# Altium project PCB_Project.PrjPcb
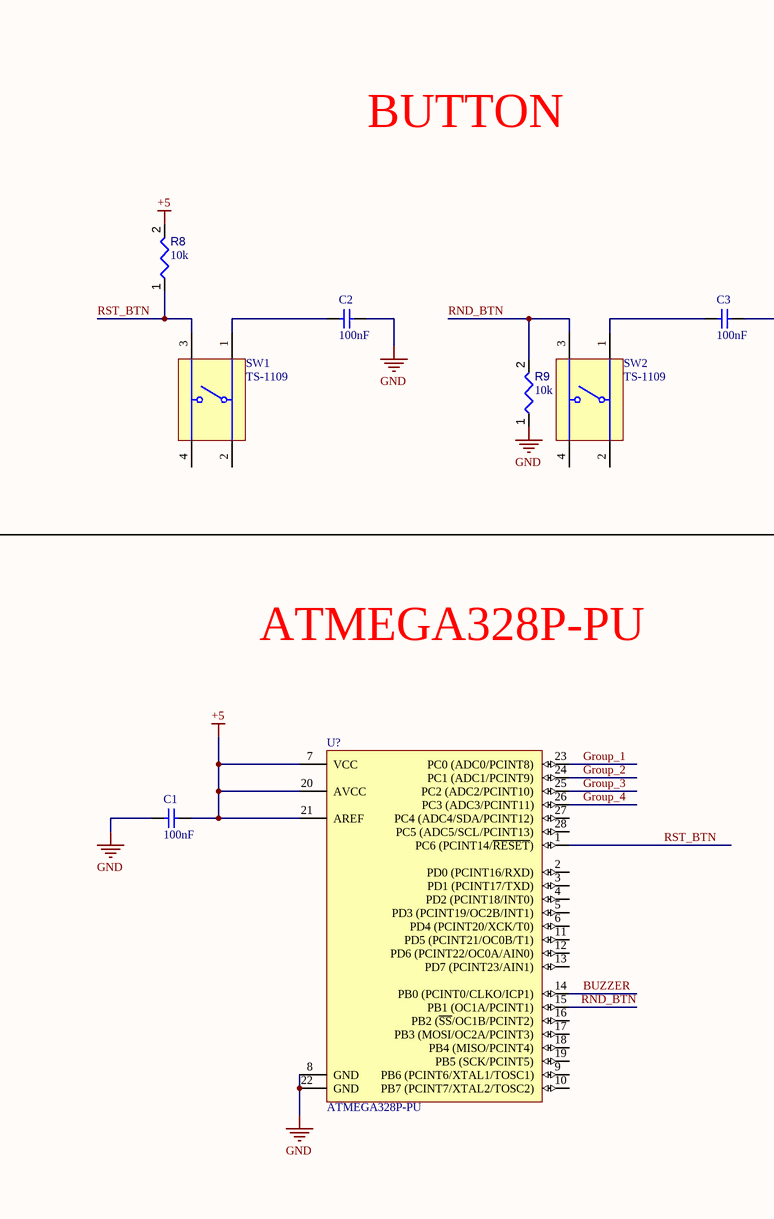
[diagram p0: Sheet1.SchDoc, left]
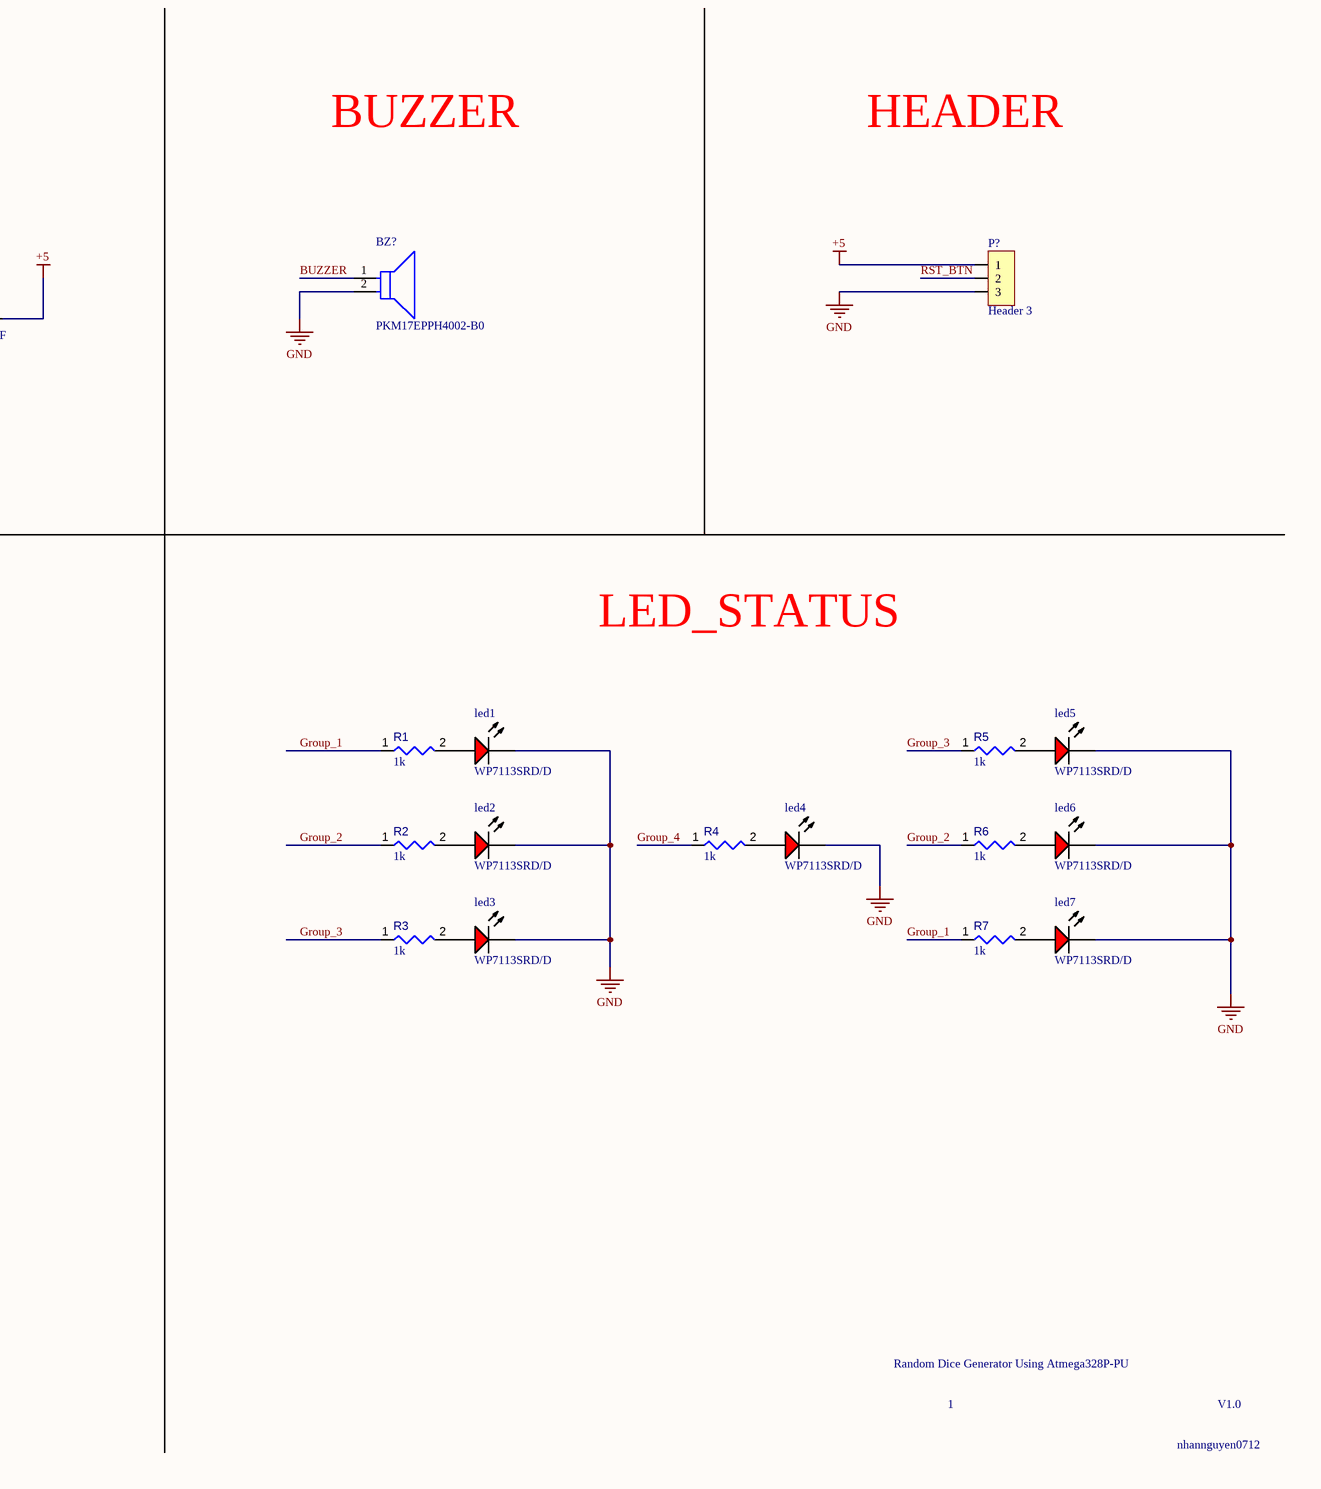
[diagram p1: Sheet1.SchDoc, right]
1 sheet, 24 parts. Net scope: global (net labels, ports and power ports of the same name join across sheets).
Board file: PCB1.PcbDoc

## Sheet Sheet1.SchDoc
size A3; SheetNumber: 1; SheetTotal: 1

### Parts
BZ?  PKM17EPPH4002-B0  [FP-PKM17EPPH4002-B0-MFG]
C1  100nF  [CAP Ceramic/W200]
C2  100nF  [CAP Ceramic/W200]
C3  100nF  [CAP Ceramic/W200]
led1  WP7113SRD/D  [KING-WP7113SRDD_V]
led2  WP7113SRD/D  [KING-WP7113SRDD_V]
led3  WP7113SRD/D  [KING-WP7113SRDD_V]
led4  WP7113SRD/D  [KING-WP7113SRDD_V]
led5  WP7113SRD/D  [KING-WP7113SRDD_V]
led6  WP7113SRD/D  [KING-WP7113SRDD_V]
led7  WP7113SRD/D  [KING-WP7113SRDD_V]
P?  Header 3  [HDR/Header/3/c1]
R1  value 1k  [RESA60-630X240]  (hidden comment: MFR-25FBF52-1K)
R2  value 1k  [RESA60-630X240]  (hidden comment: MFR-25FBF52-1K)
R3  value 1k  [RESA60-630X240]  (hidden comment: MFR-25FBF52-1K)
R4  value 1k  [RESA60-630X240]  (hidden comment: MFR-25FBF52-1K)
R5  value 1k  [RESA60-630X240]  (hidden comment: MFR-25FBF52-1K)
R6  value 1k  [RESA60-630X240]  (hidden comment: MFR-25FBF52-1K)
R7  value 1k  [RESA60-630X240]  (hidden comment: MFR-25FBF52-1K)
R8  value 10k  [RESA60-630X240]  (hidden comment: MFR-25FBF52-10K)
R9  value 10k  [RESA60-630X240]  (hidden comment: MFR-25FBF52-10K)
SW1  TS-1109  [BEST-TS-1109_V]
SW2  TS-1109  [BEST-TS-1109_V]
U?  ATMEGA328P-PU  [ATML-28P3]

### Nets
+5: C1.2 C3.2 P?.1 R8.2 U?.7(VCC) U?.20(AVCC) U?.21(AREF)
GND: BZ?.2 C1.1 C2.2 led1.2(K) led2.2(K) led3.2(K) led4.2(K) led5.2(K) led6.2(K) led7.2(K) P?.3 R9.1 U?.8(GND) U?.22(GND)
BUZZER: BZ?.1 U?.14(PB0_(PCINT0/CLKO/ICP1))
Group_1: R1.1 R7.1 U?.23(PC0_(ADC0/PCINT8))
Group_2: R2.1 R6.1 U?.24(PC1_(ADC1/PCINT9))
Group_3: R3.1 R5.1 U?.25(PC2_(ADC2/PCINT10))
Group_4: R4.1 U?.26(PC3_(ADC3/PCINT11))
RND_BTN: R9.2 SW2.3 U?.15(PB1_(OC1A/PCINT1))
RST_BTN: P?.2 R8.1 SW1.3 U?.1(PC6_(PCINT14/~{RESET}))
NetC2_1: C2.1 SW1.1
NetC3_1: C3.1 SW2.1
Netled1_1: led1.1(A) R1.2
Netled2_1: led2.1(A) R2.2
Netled3_1: led3.1(A) R3.2
Netled4_1: led4.1(A) R4.2
Netled5_1: led5.1(A) R5.2
Netled6_1: led6.1(A) R6.2
Netled7_1: led7.1(A) R7.2

Not connected (* = marked no-connect by the designer): SW1 2 4; SW2 2 4; U? 2(PD0_(PCINT16/RXD)) 3(PD1_(PCINT17/TXD)) 4(PD2_(PCINT18/INT0)) 5(PD3_(PCINT19/OC2B/INT1)) 6(PD4_(PCINT20/XCK/T0)) 9(PB6_(PCINT6/XTAL1/TOSC1)) 10(PB7_(PCINT7/XTAL2/TOSC2)) 11(PD5_(PCINT21/OC0B/T1)) 12(PD6_(PCINT22/OC0A/AIN0)) 13(PD7_(PCINT23/AIN1)) 16(PB2_(~{SS}/OC1B/PCINT2)) 17(PB3_(MOSI/OC2A/PCINT3)) 18(PB4_(MISO/PCINT4)) 19(PB5_(SCK/PCINT5)) 27(PC4_(ADC4/SDA/PCINT12)) 28(PC5_(ADC5/SCL/PCINT13))

### Notes on the sheet
- Text
- BUTTON
- BUZZER
- HEADER
- ATMEGA328P-PU
- LED_STATUS
- Random Dice Generator Using Atmega328P-PU
- 1
- V1.0
- nhannguyen0712

### Library data of the parts
BZ? = CMP-06202-000042-1: AUDIO PIEZO TRANSDUCER 25V TH; Washable: No; Self Resonant Frequency: 4kHz; Voltage Rating: 1.5V; Diameter: 17mm; Package Quantity: 1200; Termination: Pin; Max Operating Temperature: 70°C; Height: 8.7mm; Packaging: Bulk; Mount: Through Hole; Series: PK; Frequency: 4kHz; Min Operating Temperature: -20°C
C1-C3 = Capacitor NP: Capacitor non-pol
led1-led7 = CMP-007-00033-2: The Super Bright Red Source Color Device, 1.85 V, -40 to 85 degC, 2-Pin THD, RoHS, Tape and Reel; Manufacturer: Kingbright; Nominal Vf: 1.85V; Luminous Intensity: 300mcd; Viewing Angle: 30degrees; Lens Style: Diffused; RoHS Compliant: True; Datasheet Version: Rev. 6A, 07/2016; Illumination Colour: Red; Case/Package: Radial; Package Reference: WP7113SRDD; Package Quantity: 500; Datasheet URL: http://www.kingbrightusa.com/images/catalog/SPEC/WP7113SRD-D.pdf; Colour: Red; Packaging: Bulk; Forward Voltage: 1.85V; Mounting Technology: TH; Package Description: 2-Pin Through Hole Device, Dia 5.9 mm, Body Length 8.6 mm
P? = Header 3: Header, 3-Pin
R1-R7 = CMP-009-00048-4: Axial Resistor, 1 KOhm, +/- 1%, 250 mW, -55 to 155 degC, 2-Pin THD, RoHS, Bulk; Manufacturer: Yageo; Voltage Rating: 250V; Power: 250mW; Min Operating Temperature: -55°C; Max Operating Temperature: 155°C; Tolerance: 1%; Package Reference: MFR-25; Composition: CarbonFilm; Mounting Technology: TH; Packaging: Bulk; Case/Package: Axial; Datasheet URL: http://www.yageo.com/documents/recent/Yageo%20LR_MFR_2013.pdf; Package Quantity: 200; Manufacturer URL: http://www.yageo.com/; Package Description: 2-Pin Axial Lead, Dia 2.4 mm, Body Length 6.3 mm; Datasheet Version: Apr-13; RoHS Compliant: True
R8 R9 = CMP-009-00047-4: Axial Resistor, 10 KOhm, +/- 1%, 0.25 W, -55 to 155 degC, 2-Pin THD, RoHS, Bulk; Manufacturer: Yageo; Power: 250mW; Voltage Rating: 250V; Manufacturer URL: http://www.yageo.com/; Datasheet URL: http://www.yageo.com/documents/recent/Yageo%20LR_MFR_2013.pdf; Package Reference: MFR-25; Min Operating Temperature: -55°C; Mounting Technology: TH; Package Quantity: 200; Case/Package: Axial; Tolerance: 1%; RoHS Compliant: True; Datasheet Version: Apr-13; Packaging: Bulk; Max Operating Temperature: 155°C; Package Description: 2-Pin Axial Lead, Dia 2.4 mm, Body Length 6.3 mm
SW1 SW2 = CMP-011-00002-2: Tactile Switch, SPST, 12 V, 50 mA, -20 to 80 degC, 4-Pin THD; Manufacturer: Shenzhen Best; RoHS Compliant: Unknown; Manufacturer URL: www.best-dz.com/; Case/Package: TS-1109; Package Reference: TS-1109; Datasheet Version: Dec-12; Mounting Technology: TH; Package Description: 4-Pin Through Hole Device, Body 6.2 x 6.2 mm; Datasheet URL: http://datasheet.octopart.com/TS-1109-Best-Inc.-datasheet-30458100.pdf
U? = CMP-020-00004-3: 8-Bit Microcontroller with 32 KBytes In-System Programmable Flash, 23 I/Os, -40 to 85 degC, 28-Pin PDIP (28P3), RoHS, Tube; Manufacturer: Atmel; I/Os: 23; Density: 32KB; Package Version: Rev. B, 09/2001; Max Clock Frequency: 20MHz; Interface: USART; Max Supply Voltage: 5.5V; Min Supply Voltage: 1.8V; Ethernet Channels: 0; RAM Size: 2KB; RoHS Compliant: True; Datasheet URL: http://www.atmel.com/images/Atmel-8271-8-bit-AVR-Microcontroller-ATmega48A-48PA-88A-88PA-168A-168PA-328-328P_datasheet_Complete.pdf; Packaging: Rail/Tube; Manufacturer URL: http://www.atmel.com/; Mounting Technology: TH; Package URL: http://www.atmel.com/images/Atmel-8271-8-bit-AVR-Microcontroller-ATmega48A-48PA-88A-88PA-168A-168PA-328-328P_datasheet_Complete.pdf; Datasheet Version: Rev. 8271J, 11/2015; Package Description: 28-Pin Plastic Dual Inline Package, Body 34.671 x 7.3025 mm, Pitch 2.54 mm; Package Quantity: 14; Min Operating Temperature: -40°C; Max Operating Temperature: 85°C; Case/Package: DIP; Pins: 28; Package Reference: 28P3